# EAGLE schematic IVSense_one_circuit (EAGLE 6.1)
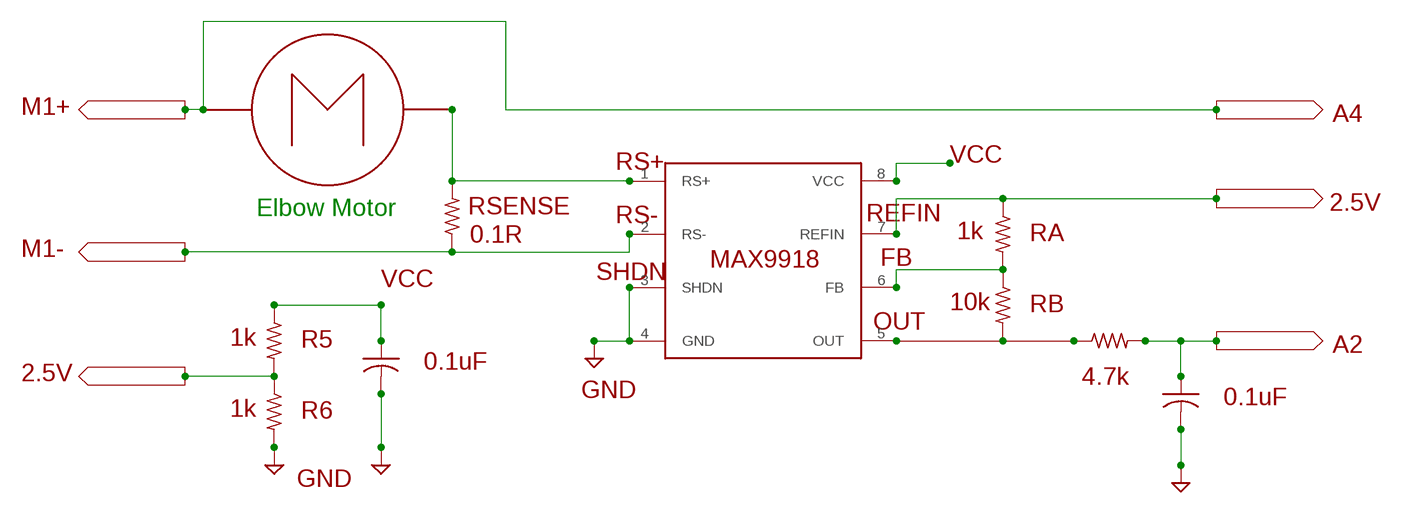
[diagram p0: schematic, sheet 1]

## Parts
C1  0.1uF  C-US025-025X050  [C025-025X050]
C3  0.1uF  C-US025-025X050  [C025-025X050]
MAX9918  MAX9918  [SO08]
R5  1k  R-US_0204/5  [0204/5]
R6  1k  R-US_0204/5  [0204/5]
RA  1k  R-US_0204/5  [0204/5]
RB  10k  R-US_0204/5  [0204/5]
RF_E  4.7k  R-US_0204/5  [0204/5]
RSENSE  0.1R  R-US_0204/5  [0204/5]
U$4  MOTOR_GENERIC  [MOTOR_PACKAGE]

## Nets
2.5V: R5.2 R6.1
A2: C3.1 RF_E.2
GND: C1.2 C3.2 MAX9918.4(GND) R6.2
M1+: U$4.P$1(IN)
M1-: MAX9918.2(RS-) RSENSE.1
N$1: MAX9918.6(FB) RA.2 RB.1
N$3: MAX9918.1(RS+) RSENSE.2 U$4.P$2(OUT)
N$8: MAX9918.7(REFIN) RA.1
N$10: RF_E.1
N$13: RB.2
N$14: MAX9918.5(OUT)
VCC: C1.1 MAX9918.8(VCC) R5.1
Unconnected: MAX9918.3(SHDN)

## Notes on the sheet
- RS+
- Elbow Motor | REFIN
- RS-
- MAX9918 | FB
- SHDN
- OUT

## Library data of the parts
C1 C3 = adafruit:C-US: CAPACITOR, American symbol
MAX9918 = CAP:MAX9918: Maxim MAX9918 -20V to +75V Input Range, Precision Uni-/Bidirectional, Current-Sense Amplifiers
R5 R6 RA RB RF_E RSENSE = resistor:R-US_: RESISTOR, American symbol
U$4 = CAP:MOTOR_GENERIC: it's just a goddamn motor symbol, leave me alone